# EAGLE design 517_lora_arduino_ES920 (EAGLE 9.6.2)
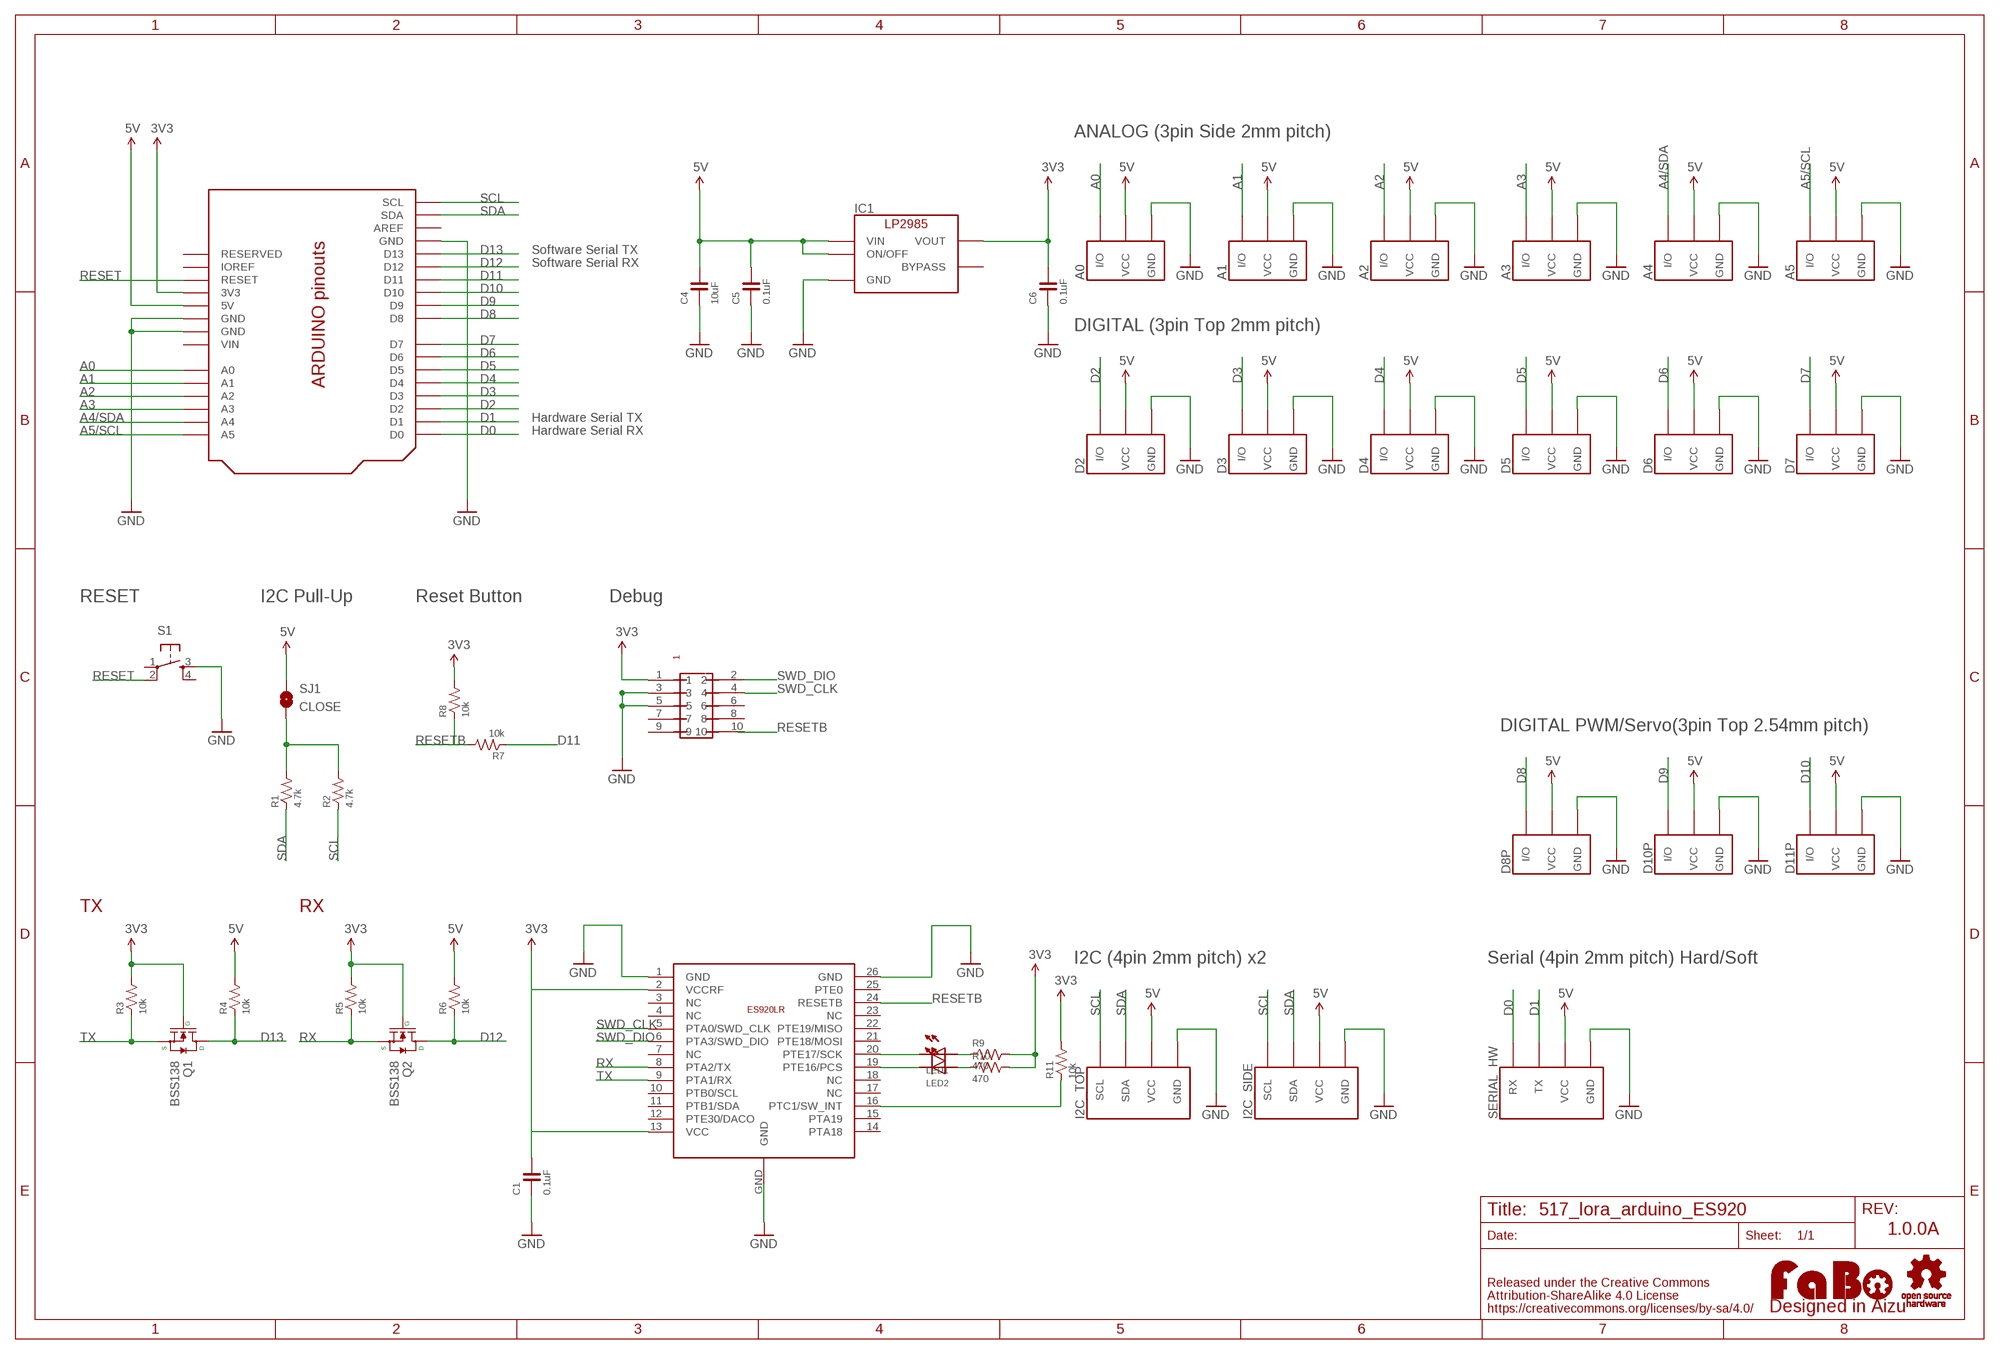
[diagram p0: schematic, sheet 1]

## Parts
A0  FABO_BRICK_3PIN-S03B-PASK-2_LONG  [FABO_BRICK_3PIN_S03B-PASK-2_LONG]
A1  FABO_BRICK_3PIN-S03B-PASK-2_LONG  [FABO_BRICK_3PIN_S03B-PASK-2_LONG]
A2  FABO_BRICK_3PIN-S03B-PASK-2_LONG  [FABO_BRICK_3PIN_S03B-PASK-2_LONG]
A3  FABO_BRICK_3PIN-S03B-PASK-2_LONG  [FABO_BRICK_3PIN_S03B-PASK-2_LONG]
A4  FABO_BRICK_3PIN-S03B-PASK-2_LONG  [FABO_BRICK_3PIN_S03B-PASK-2_LONG]
A5  FABO_BRICK_3PIN-S03B-PASK-2_LONG  [FABO_BRICK_3PIN_S03B-PASK-2_LONG]
C1  0.1uF  CAPACITOR-0603_NARROW  [0603-NARROW]
C4  10uF  CAPACITOR-0603_NARROW  [0603-NARROW]
C5  0.1uF  CAPACITOR-0603_NARROW  [0603-NARROW]
C6  0.1uF  CAPACITOR-0603_NARROW  [0603-NARROW]
D2  FABO_BRICK_3PIN-B03B-PASK-1  [FABO_BRICK_3PIN_B03B-PASK-1]
D3  FABO_BRICK_3PIN-B03B-PASK-1  [FABO_BRICK_3PIN_B03B-PASK-1]
D4  FABO_BRICK_3PIN-B03B-PASK-1  [FABO_BRICK_3PIN_B03B-PASK-1]
D5  FABO_BRICK_3PIN-B03B-PASK-1  [FABO_BRICK_3PIN_B03B-PASK-1]
D6  FABO_BRICK_3PIN-B03B-PASK-1  [FABO_BRICK_3PIN_B03B-PASK-1]
D7  FABO_BRICK_3PIN-B03B-PASK-1  [FABO_BRICK_3PIN_B03B-PASK-1]
D8P  FABO_BRICK_3PIN-HEADER  [FABO_BRICK_3PIN_HEADER]
D10P  FABO_BRICK_3PIN-HEADER  [FABO_BRICK_3PIN_HEADER]
D11P  FABO_BRICK_3PIN-HEADER  [FABO_BRICK_3PIN_HEADER]
I2C_SIDE  FABO_BRICK_I2C-S04B-PASK-2_LONG  [FABO_BRICK_I2C_S04B-PASK-2_LONG]
I2C_TOP  FABO_BRICK_I2C-B04B-PASK-1  [FABO_BRICK_I2C_B04B-PASK-1]
IC1  LP2985-33DBV  [SOT-23-5]
LED1  LED-0603  [0603]
LED2  LED-0603  [0603]
LOGO1  LOGO_FABO-M  [LOGO_FABO_M]
Q1  BSS138  MOSFET-N  [SOT23-3]
Q2  BSS138  MOSFET-N  [SOT23-3]
R1  4.7k  RESISTOR-0603  [0603]
R2  4.7k  RESISTOR-0603  [0603]
R3  10k  RESISTOR-0603-NARROW  [0603-NARROW]
R4  10k  RESISTOR-0603-NARROW  [0603-NARROW]
R5  10k  RESISTOR-0603-NARROW  [0603-NARROW]
R6  10k  RESISTOR-0603-NARROW  [0603-NARROW]
R7  10k  RESISTOR-0603-NARROW  [0603-NARROW]
R8  10k  RESISTOR-0603-NARROW  [0603-NARROW]
R9  470  RESISTOR-0603-NARROW  [0603-NARROW]
R10  470  RESISTOR-0603-NARROW  [0603-NARROW]
R11  10k  RESISTOR-0603-NARROW  [0603-NARROW]
S1  TACT-SWITCH-6MM  [DTS_6_V]
SERIAL_HW  FABO_BRICK_SERIAL-B04B-PASK-1  [FABO_BRICK_SERIAL_B04B-PASK-1]
SJ1  CLOSE  SMD-JUMPER-2-CLOSE  [SMD-JUMPER-2-CLOSE]
U1  ARDUINO_UNO_R3_SHIELD-OUTIN  [ARDUINO_SHIELD_OUTIN]
U$3  LOGO_OSHW-M_BOTTOM  [LOGO_OSHW_M_BOTTOM]
U$15  PIN-HEADER-SMT(1.27MM)2X5  [PIN-HEADER-SMT(1.27MM)2X5]
U$16  ES920LR  [ES920LR]

## Nets
3V3: C1.2 C6.2 IC1.5(VOUT) Q1.1(G) Q2.1(G) R3.2 R5.2 R8.2 R9.2 R10.2 R11.2 U1.3V3 U$15.1 U$16.2(VCCRF) U$16.13(VCC)
5V: A0.VCC A1.VCC A2.VCC A3.VCC A4.VCC A5.VCC C4.2 C5.2 D2.VCC D3.VCC D4.VCC D5.VCC D6.VCC D7.VCC D8P.VCC D10P.VCC D11P.VCC I2C_SIDE.VCC I2C_TOP.VCC IC1.1(VIN) IC1.3(ON/OFF) R4.2 R6.2 SERIAL_HW.VCC SJ1.1 U1.5V
A0: A0.I/O U1.A0
A1: A1.I/O U1.A1
A2: A2.I/O U1.A2
A3: A3.I/O U1.A3
A4/SDA: A4.I/O U1.A4
A5/SCL: A5.I/O U1.A5
D0: SERIAL_HW.RX U1.D0
D1: SERIAL_HW.TX U1.D1
D2: D2.I/O U1.D2
D3: D3.I/O U1.D3
D4: D4.I/O U1.D4
D5: D5.I/O U1.D5
D6: D6.I/O U1.D6
D7: D7.I/O U1.D7
D8: D8P.I/O U1.D8
D9: D10P.I/O U1.D9
D10: D11P.I/O U1.D10
D11: R7.1 U1.D11
D12: Q2.3(D) R6.1 U1.D12
D13: Q1.3(D) R4.1 U1.D13
GND: A0.GND A1.GND A2.GND A3.GND A4.GND A5.GND C1.1 C4.1 C5.1 C6.1 D2.GND D3.GND D4.GND D5.GND D6.GND D7.GND D8P.GND D10P.GND D11P.GND I2C_SIDE.GND I2C_TOP.GND IC1.2(GND) S1.3 SERIAL_HW.GND U1.GND1(GND) U1.GND2(GND) U1.GND3(GND) U$15.3 U$15.5 U$16.1(GND) U$16.26(GND) U$16.GND
N$1: R1.2 R2.2 SJ1.2
N$4: LED2.CATHODE U$16.19(PTE16/PCS)
N$5: LED1.CATHODE U$16.20(PTE17/SCK)
N$6: LED1.ANODE R9.1
N$7: LED2.ANODE R10.1
N$8: R11.1 U$16.16(PTC1/SW_INT)
RESET: S1.2 U1.RESET
RESETB: R7.2 R8.1 U$15.10 U$16.24(RESETB)
RX: Q2.2(S) R5.1 U$16.8(PTA2/TX)
SCL: I2C_SIDE.SCL I2C_TOP.SCL R2.1 U1.SCL
SDA: I2C_SIDE.SDA I2C_TOP.SDA R1.1 U1.SDA
SWD_CLK: U$15.4 U$16.5(PTA0/SWD_CLK)
SWD_DIO: U$15.2 U$16.6(PTA3/SWD_DIO)
TX: Q1.2(S) R3.1 U$16.9(PTA1/RX)
Unconnected: IC1.4(BYPASS) S1.1 S1.4 U1.AREF U1.IOREF U1.RESERVED U$15.6 U$15.7 U$15.8 U$15.9 U$16.3(NC) U$16.4(NC) U$16.7(NC) U$16.10(PTB0/SCL) U$16.11(PTB1/SDA) U$16.12(PTE30/DACO) U$16.14(PTA18) U$16.15(PTA19) U$16.17(NC) U$16.18(NC) U$16.21(PTE18/MOSI) U$16.22(PTE19/MISO) U$16.23(NC) U$16.25(PTE0)

## Notes on the sheet
- ANALOG (3pin Side 2mm pitch)
- Software Serial TX
- Software Serial RX
- DIGITAL (3pin Top 2mm pitch)
- Hardware Serial TX
- Hardware Serial RX
- RESET | I2C Pull-Up | Reset Button | Debug
- DIGITAL PWM/Servo(3pin Top 2.54mm pitch)
- TX | RX
- I2C (4pin 2mm pitch) x2 | Serial (4pin 2mm pitch) Hard/Soft
- 1.0.0A

## Power pins joined to a net without a drawn wire
VIN: U1.VIN

## Library data of the parts
A0 A1-A5 D2-D7 D8P D10P D11P = FaBo-Template:FABO_BRICK_3PIN: FaBo Brick 3pin
C1 C4-C6 = FaBo-Capacitor:CAPACITOR: CAPACITOR
I2C_SIDE I2C_TOP = FaBo-Template:FABO_BRICK_I2C: FaBo Brick I2C
IC1 = FaBo-Supply:LP2985: LP2985
LED1 LED2 = FaBo-LED:LED
LOGO1 = component:LOGO_FABO
Q1 Q2 = FaBo-etc:MOSFET-N
R1-R11 = FaBo-Resistors:RESISTOR: RESISTOR
S1 = FaBo-Switch:TACT-SWITCH
SERIAL_HW = FaBo-Template:FABO_BRICK_SERIAL: FaBo Brick Serial
SJ1 = FaBo-Supply:SMD-JUMPER-2
U1 = FaBo-Boards:ARDUINO_UNO_R3_SHIELD
U$3 = component:LOGO_OSHW
U$15 = GClue:PIN-HEADER-SMT(1.27MM)2X5: PIN-HEADER-SMT (1.27MM) 2x5
U$16 = FaBo-LoRa:ES920LR

## Board
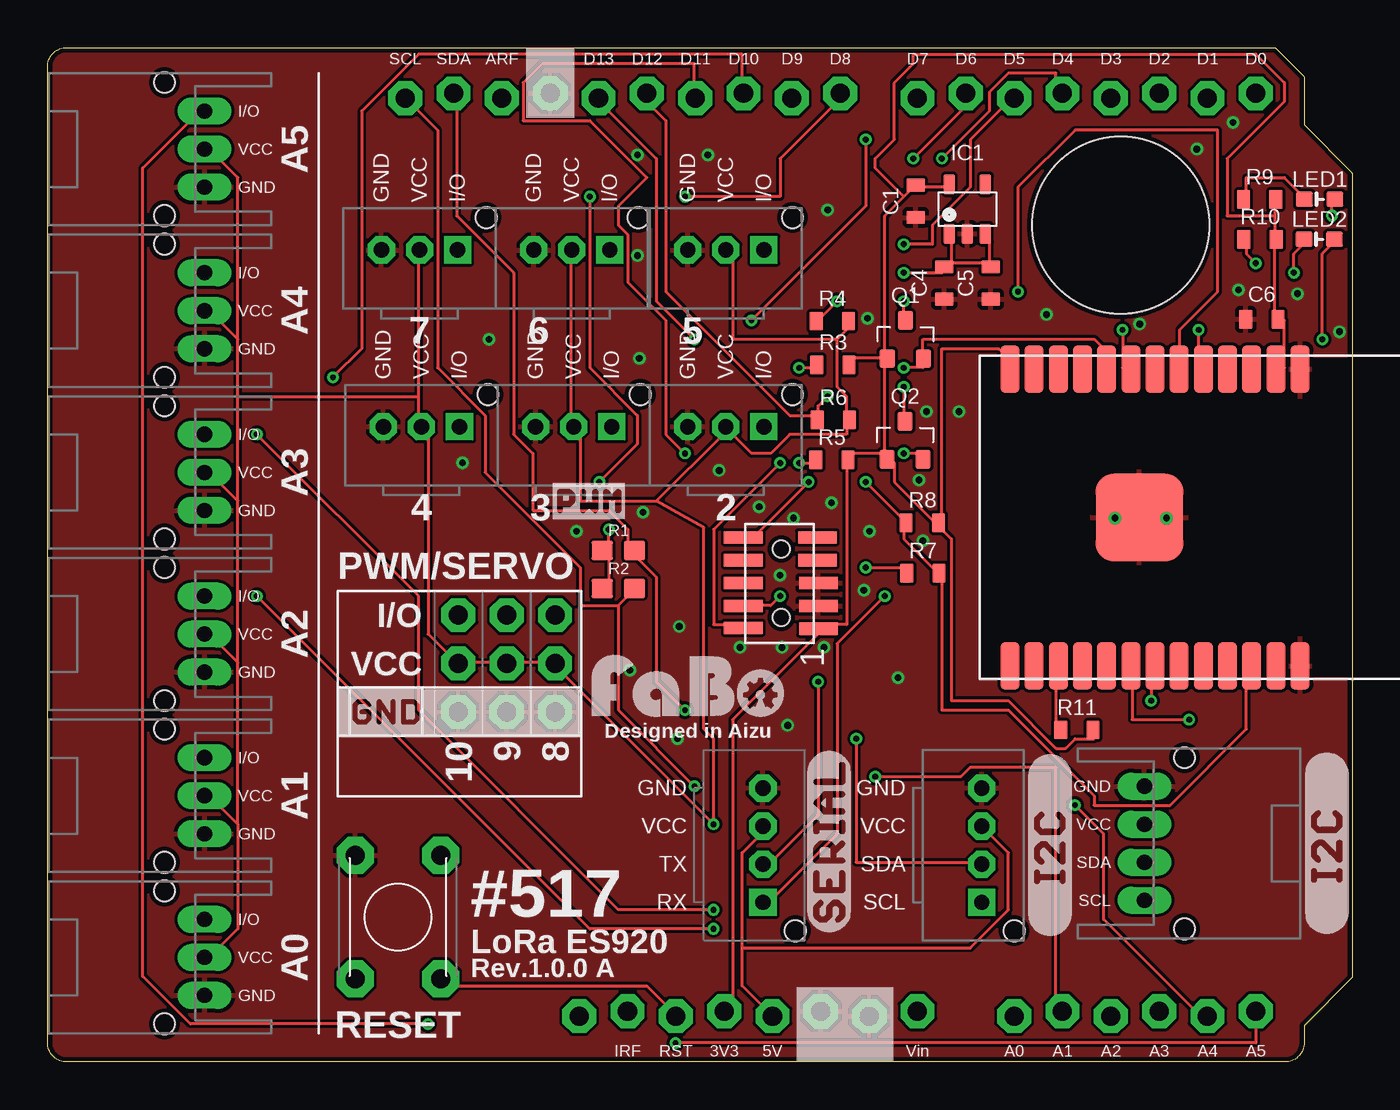
[diagram p1: board, top side]
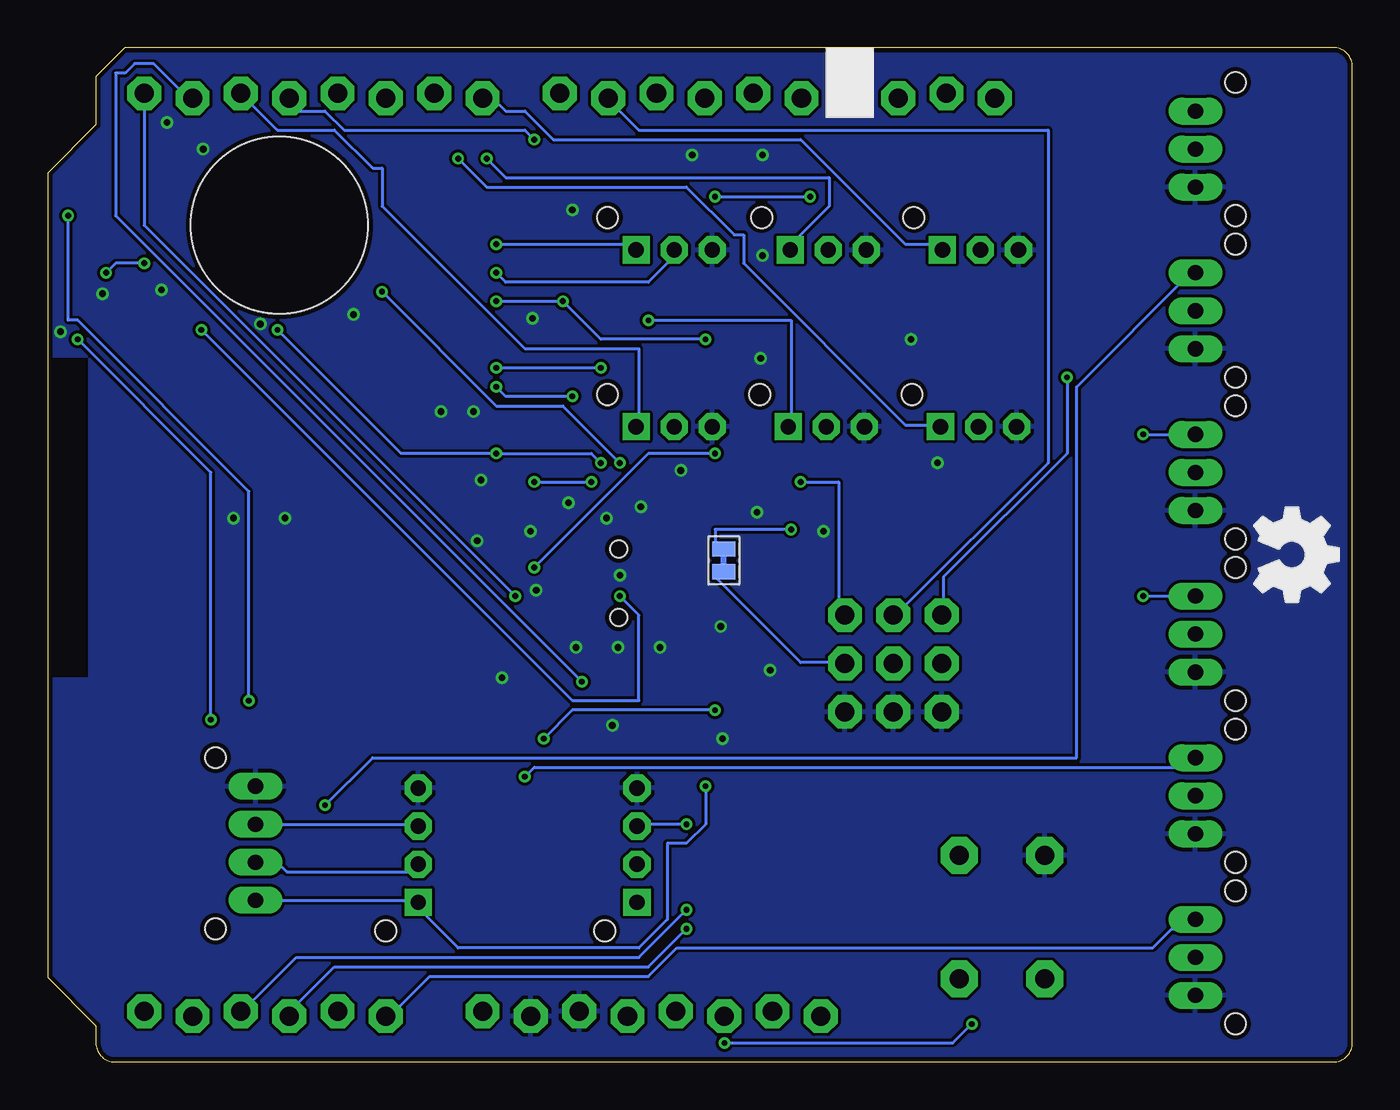
[diagram p2: board, bottom side, seen from below]

Size 68.58 x 53.34 mm. Coordinates in mm from the lower left corner, seen from the top.
Copper layers (1*16): Top 0.035mm / dielectric 1.6mm / Bottom 0.035mm
Design rules "PCBway": minimum track width 6mil, minimum drill 12mil, track to track 6mil, track to pad 6mil, pad to pad 6mil, via to via 6mil, smd to smd 6mil, copper to edge 10mil, drill to drill 10mil, minimum pad ring 10mil, minimum via ring 6mil, stop-mask expansion 2mil, vias tented up to drill 100mil, thermal gap 8mil
Holes 9.3 mm at 56.4,44

### Footprints (pad centres in the part's own frame; a part is rotated, then mirrored left to right if it is on the bottom)
FABO_BRICK_3PIN_S03B-PASK-2_LONG = drill 0.8 pad 1.422 long: GND -2,0; I/O 2,0; VCC 0,0 | hole 1.1: 3.5,2.1; -3.5,2.1
0603-NARROW = smd 0.71 x 1: 1 -0.85,0; 2 0.85,0
FABO_BRICK_3PIN_B03B-PASK-1 = drill 0.8 pad 1.422 octagon: GND -2,0; VCC 0,0 | drill 0.8 pad 1.422 square: I/O 2,0 | hole 1.1: 3.5,1.7
FABO_BRICK_3PIN_HEADER = drill 1 pad 1.778 octagon: GND -2.54,0; I/O 2.54,0; VCC 0,0
FABO_BRICK_I2C_S04B-PASK-2_LONG = drill 0.8 pad 1.422 long: GND -3,0; SCL 3,0; SDA 1,0; VCC -1,0 | hole 1.1: 4.5,2.1; -4.5,2.1
FABO_BRICK_I2C_B04B-PASK-1 = drill 0.8 pad 1.422 octagon: GND -3,0; SDA 1,0; VCC -1,0 | drill 0.8 pad 1.422 square: SCL 3,0 | hole 1.1: 4.5,1.7
SOT-23-5 = smd 0.6 x 1.05: 1 -0.95,-1.3; 2 0,-1.3; 3 0.95,-1.3; 4 0.95,1.3; 5 -0.95,1.3
0603 = smd 0.9 x 0.8: ANODE -0.8,0; CATHODE 0.8,0
SOT23-3 = smd 0.8 x 1: 1 -0.95,-1; 2 0.95,-1; 3 0,1
0603' = smd 1.1 x 1: 1 -0.85,0; 2 0.85,0
DTS_6_V = drill 1 pad 1.93 octagon: 1 -3.25,2.25; 2 3.25,2.25; 3 -3.25,-2.25; 4 3.25,-2.25
FABO_BRICK_SERIAL_B04B-PASK-1 = drill 0.8 pad 1.422 octagon: GND -3,0; TX 1,0; VCC -1,0 | drill 0.8 pad 1.422 square: RX 3,0 | hole 1.1: 4.5,1.7
SMD-JUMPER-2-CLOSE = smd 0.8 x 1.2: 1 -0.6,0; 2 0.6,0
ARDUINO_SHIELD_OUTIN = drill 1 pad 1.778 octagon: 3V3 35.56,2.667; 5V 38.1,2.413; A0 50.8,2.413; A1 53.34,2.667; A2 55.88,2.413; A3 58.42,2.667; A4 60.96,2.413; A5 63.5,2.667; AREF 23.876,50.673; D0 63.5,50.927; D1 60.96,50.673; D2 58.42,50.927; D3 55.88,50.673; D4 53.34,50.927; D5 50.8,50.673; D6 48.26,50.927; D7 45.72,50.673; D8 41.656,50.927; D9 39.116,50.673; D10 36.576,50.927; D11 34.036,50.673; D12 31.496,50.927; D13 28.956,50.673; GND1 43.18,2.413; GND2 40.64,2.667; GND3 26.416,50.927; IOREF 30.48,2.667; RESERVED 27.94,2.413; RESET 33.02,2.413; SCL 18.796,50.673; SDA 21.336,50.927; VIN 45.72,2.667
PIN-HEADER-SMT(1.27MM)2X5 = smd 0.635 x 2.032: 1 -2.4,-1.95; 2 -2.35,2; 3 -1.2,-1.95; 4 -1.2,2; 5 0,-1.95; 6 0,2; 7 1.2,-1.9; 8 1.2,2; 9 2.4,-1.9; 10 2.4,2 | hole 0.9: 1.8,0; -1.8,0
ES920LR = smd 2.5 x 1: 1 -7.8,5.84; 2 -7.8,4.57; 3 -7.8,3.3; 4 -7.8,2.03; 5 -7.8,0.76; 6 -7.8,-0.51; 7 -7.8,-1.78; 8 -7.8,-3.05; 9 -7.8,-4.32; 10 -7.8,-5.59; 11 -7.8,-6.86; 12 -7.8,-8.13; 13 -7.8,-9.4; 14 7.8,-9.4; 15 7.8,-8.13; 16 7.8,-6.86; 17 7.8,-5.59; 18 7.8,-4.32; 19 7.8,-3.05; 20 7.8,-1.78; 21 7.8,-0.51; 22 7.8,0.76; 23 7.8,2.03; 24 7.8,3.3; 25 7.8,4.57; 26 7.8,5.84 | smd 4.6 x 4.6: GND 0,-2.6

### Placement (x,y rotation side)
A0  8.25,5.5 90 top
A1  8.25,14 90 top
A2  8.25,22.5 90 top
A3  8.25,31 90 top
A4  8.25,39.5 90 top
A5  8.25,48 90 top
C1  45.62,45.26 90 top
C4  47.12,40.95 90 top
C5  49.57,40.95 90 top
C6  63.81,39.05 0 top
D2  35.65,33.4 0 top
D3  27.65,33.4 0 top
D4  19.65,33.4 0 top
D5  35.65,42.7 0 top
D6  27.55,42.7 0 top
D7  19.55,42.7 0 top
D8P  26.67,20.95 90 top
D10P  24.13,20.95 90 top
D11P  21.59,20.95 90 top
I2C_SIDE  57.65,11.5 270 top
I2C_TOP  49.1,11.4 270 top
IC1  48.34,44.85 0 top
LED1  66.86,45.36 0 top
LED2  66.83,43.26 0 top
LOGO1  33.66,17.78 0 top
Q1  45.09,37.98 0 top
Q2  45.06,32.69 0 top
R1  4.7k  [0603']  30,26.9 180 top
R2  4.7k  [0603']  30,24.9 180 top
R3  41.27,36.66 0 top
R4  41.24,38.96 0 top
R5  41.22,31.66 0 top
R6  41.3,33.76 0 top
R7  46,25.7 0 top
R8  45.97,28.36 0 top
R9  63.7,45.35 0 top
R10  63.72,43.26 0 top
R11  54.09,17.46 0 top
S1  18.41,7.62 270 top
SERIAL_HW  37.6,11.4 270 top
SJ1  33.03,26.37 90 bottom
U1  0,0 0 top
U$2  [LOGO_SILK_SERIAL2]  42.25,11.6 90 top
U$3  3.17,26.67 90 top
U$5  [LOGO_SILK_PWM]  26.55,28.55 0 top
U$11  [LOGO_SILK_I2C]  68.4,11.5 90 top
U$12  [LOGO_SILK_I2C]  53.85,11.4 90 top
U$15  38.56,25.18 90 top
U$16  59.98,28.64 270 top
U$19  [LOGO_SILK_GND]  15.88,17.14 0 top

### Tracks (layer width: path | path; a pad name or v marks a point on that pad's centre or on a via)
3V3
  Top 0.152: 64.5,44.5 64.5,45 R9.2 | 64.5,44.5 64.5,43.5 R10.2 64.5,43 64.5,39.5 C6.2 65,39 65,36.5 U$16.2 | IC1.5 47.5,46 46,46 C1.2 45.5,46 45,45.5 | 44,37 42,37 R3.2 | 45,45.5 44,44.5 44,37 | 44,37 Q1.1 44,36.5 44,32 | 64.5,44.5 62,44.5 62,47.5 65,50.5 65,51.5 63.5,53 45.5,53 45.5,52.5 44.5,51.5 44.5,48.5 43.5,47.5 43.5,47 45,45.5 | 44,32 42,32 R5.2 42,31.5 42,23 41,23 U$15.1 40.5,22.5 36,18 36,3 U1.3V3 | R8.2 46.5,28.5 44.5,30.5 44.5,31.5 Q2.1 44,32 | R11.2 55,17 54,17 53.5,16.5 53,16.5 50.5,19 47.5,19 47.5,27.5 47,28 R8.2 | U$16.13 50.5,36.5 50.5,37 50,37.5 47,37.5 47,28.5 R8.2
5V  (via drill 0.3)
  Top 0.152: D6.VCC 27.5,42.5 27.5,33.5 D3.VCC 28,33 28,29.5 32,29.5 | 32,29.5 35.5,33 D2.VCC 36,33 37,32 38,32 39,33 42,33 42,33.5 R6.2 42,34 42,35 41.5,35.5 41.5,38 | 41.5,38 42,38.5 R4.2 | 47.5,42 47.5,43.5 IC1.1 | 49.5,42 49.5,43.5 IC1.3 | 49.5,42 47.5,42 | 47.5,42 C4.2 47,41.5 v45,41.5 | 49.5,42 C5.2 | 41.5,38 36,38 36,42.5 D5.VCC | 36.5,6 36.5,4 38,2.5 U1.5V | 36.5,6 36.5,11 37.5,12 SERIAL_HW.VCC | I2C_TOP.VCC 50.5,11 50.5,8 48.5,6 36.5,6 | 19.5,35 19.5,33.5 D4.VCC 20,33 20,22.5 21.5,21 D11P.VCC 22,21 24,21 D10P.VCC 24.5,21 26.5,21 D8P.VCC 27,20.5 v35,12.5 35,17 34.5,17.5 34.5,28.1 32,29.5 | 19.5,35 19.5,42.5 D7.VCC | 10,12.5 10,7 8.5,5.5 A0.VCC | 10,12.5 8.5,14 A1.VCC | 10,21 8.5,22.5 A2.VCC | 10,12.5 10,21 | 10,29.5 8.5,31 A3.VCC | 10,21 10,29.5 | 10,38 8.5,39.5 A4.VCC | 10,29.5 10,35 | 10,35 10,38 | 10,38 10,46.5 8.5,48 A5.VCC | 10,35 19.5,35
  Bottom 0.152: v45,41.5 44.5,41 37,41 35.5,42.5 D5.VCC | I2C_SIDE.VCC 49.5,12.5 I2C_TOP.VCC | SJ1.1 33.5,25.5 29,21 27,21 D8P.VCC | v35,12.5 37.5,12.5 SERIAL_HW.VCC
A0
  Bottom 0.152: A0.I/O 8.5,7.5 9,7 9.5,7 10.5,6 35.5,6 37,4.5 48.5,4.5 50.5,2.5 U1.A0
A1  (via drill 0.3)
  Top 0.152: v43.5,15 48,15 48.5,15.5 53,15.5 53,3 U1.A1
  Bottom 0.152: v43.5,15 43,15.5 9,15.5 8.5,16 A1.I/O
A2  (via drill 0.3)
  Top 0.152: v11,24.5 28.5,7 v35,7
  Bottom 0.152: v11,24.5 A2.I/O | v35,7 37,5 53.5,5 56,2.5 U1.A2
A3  (via drill 0.3)
  Top 0.152: v11,33 19.5,24.5 19.5,18.5 30,8 v35,8
  Bottom 0.152: v11,33 A3.I/O | v35,8 37.5,5.5 55.5,5.5 58,3 U1.A3
A4/SDA  (via drill 0.3)
  Top 0.152: v54,13.5 55.5,12 55.5,7.5 60.5,2.5 U1.A4
  Bottom 0.152: v54,13.5 51.5,16 14.5,16 14.5,35.5 8.5,41.5 A4.I/O
A5/SCL  (via drill 0.3)
  Top 0.152: v20,2 7.5,2 5,4.5 5,47 8,50 A5.I/O | v33,1 63.5,1 U1.A5
  Bottom 0.152: v20,2 21,1 v33,1
D0  (via drill 0.3)
  Top 0.152: v44,24.5 41.5,22 41.5,12 38,8.5 SERIAL_HW.RX
  Bottom 0.152: v44,24.5 63.5,44 U1.D0
D1  (via drill 0.3)
  Top 0.152: v40.5,20 40.5,13 38,10.5 SERIAL_HW.TX
  Bottom 0.152: v40.5,20 65,44.5 65,52 64.5,52 64,52.5 63,52.5 61.5,51 61,51 U1.D1
D2
  Bottom 0.152: D2.I/O 37.5,33.5 37.5,37.5 43.5,37.5 51,45 51,47 51.5,47 53.5,49 56.5,49 58,50.5 U1.D2
D3  (via drill 0.3)
  Top 0.152: v37,39 43,45 v43,48.5
  Bottom 0.152: v37,39 29.5,39 29.5,33.5 D3.I/O | v43,48.5 43.5,49 53,49 54,50 55.5,50 56,50.5 U1.D3
D4  (via drill 0.3)
  Top 0.152: v47,47.5 49.5,50 49.5,51 50.5,52 53,52 53,51 U1.D4
  Bottom 0.152: v47,47.5 45.5,46 35,46 32.5,43.5 32,43.5 32,42 23.5,33.5 22,33.5 D4.I/O
D5  (via drill 0.3)
  Top 0.152: v45,43 46.5,43 46.5,44 48.5,46 48.5,48.5 50.5,50.5 U1.D5
  Bottom 0.152: v45,43 38,43 D5.I/O
D6  (via drill 0.3)
  Top 0.152: v45.5,47.5 48,50 48,50.5 U1.D6
  Bottom 0.152: v45.5,47.5 44.5,46.5 27.5,46.5 27.5,45 29.5,43 D6.I/O
D7
  Bottom 0.152: D7.I/O 22,43 23.5,43 29,48.5 42,48.5 43.5,50 44.5,50 45,50.5 45.5,50.5 U1.D7
D8  (via drill 0.3)
  Top 0.152: v29,30.5 31,32.5 31,34 28.5,36.5 v28.5,45.5 | v33.5,45.5 38.5,45.5 38.5,47.5 41.5,50.5 U1.D8
  Bottom 0.152: v29,30.5 27,30.5 27,23.5 D8P.I/O | v33.5,45.5 v28.5,45.5
D9
  Bottom 0.152: D10P.I/O 24,23.5 16,31.5 16,49 37.5,49 39,50.5 U1.D9
D10  (via drill 0.3)
  Top 0.152: v15,36 16.5,37.5 16.5,50 19.5,53 36.5,53 36.5,51 U1.D10
  Bottom 0.152: v15,36 15,32 21.5,25.5 21.5,23.5 D11P.I/O
D11  (via drill 0.3)
  Top 0.152: v43,26 45,26 R7.1 | v33.5,32 32.5,33 32.5,39 30.5,41 30.5,43.5 30,44 30,45 31.5,46.5 28.5,49.5 25,49.5 25,51.5 26,52.5 34,52.5 34,51 U1.D11
  Bottom 0.152: v43,26 37,32 v33.5,32
D12  (via drill 0.3)
  Top 0.152: 40.5,34 39,34 32.5,40.5 32.5,49.5 31.5,50.5 U1.D12 | v45,35.5 45,34 Q2.3 | v41,35 40.5,34.5 40.5,34 | 40.5,34 R6.1
  Bottom 0.152: v45,35.5 44.5,35 v41,35
D13  (via drill 0.3)
  Top 0.152: v41.5,40 40.5,39 R4.1 | v45,40 45,39 Q1.3 | v34,38 32,40 32,47.5 29,50.5 U1.D13
  Bottom 0.152: v45,40 v41.5,40 39.5,38 v34,38
GND  (via drill 0.35)
  other vias: 41,44.8 60.4,48 52.5,39.3 47.9,34.2 31.1,37 23.2,38 62.3,49.4 67.9,38.4 56.1,28.6 58.8,28.6 41.2,29.4 35.3,31.1 21.8,31.5 62.6,40.6 65.7,40.4 42.9,24.8 43.2,27.9 37.4,29.2 33.2,22.9 27.8,27.9 33.1,17 31,47.7 31,42.4 31.3,28.9 30.6,20.6 46.2,34.2 45.8,30.6 34.7,47.7 44.7,20.2 40.8,21.8 38.6,21.8 36.4,21.8 39.2,28.6 38.9,17.7 38.5,25.6 43.1,39.1 57.4,38.8 46,27.4
  pour Bottom: 0,0 0,53.34 68.58,53.34 68.58,1.27 68.58,0
  pour Top: 0,0 0,53.34 68.58,53.34 68.58,0
N$1  (via drill 0.3)
  Top 0.152: R2.2 29.5,25 29.5,26.5 R1.2 29.5,27 v29.5,28
  Bottom 0.152: v29.5,28 33.5,28 33.5,27 SJ1.2
N$4  (via drill 0.3)
  Top 0.152: v67,38 67,42.5 67.5,43 LED2.CATHODE | v60,18 57,18 57,20.5 U$16.19
  Bottom 0.152: v67,38 60,31 v60,18
N$5  (via drill 0.3)
  Top 0.152: v67.5,44.5 67.5,45 LED1.CATHODE | v58,19 58,20.5 U$16.20
  Bottom 0.152: v67.5,44.5 67.5,39 67,39 58,30 v58,19
N$6
  Top 0.152: LED1.ANODE 66,45.5 65,46.5 63,46.5 63,45.5 R9.1
N$7  (via drill 0.3)
  Top 0.152: v65.5,41.5 65.5,42.5 66,43 LED2.ANODE | v63.5,42 63,42.5 63,43 R10.1
  Bottom 0.152: v65.5,41.5 65,42 v63.5,42
N$8
  Top 0.152: R11.1 53,17.5 53,20.5 U$16.16
RESET
  Top 0.152: U1.RESET 33,2.5 31.5,4 21,4 S1.2
RESETB  (via drill 0.3)
  Top 0.152: v40,30.5 37,27.5 U$15.10 | v43,30.5 45,28.5 R8.1 45,28 45,27.5 46.5,26 R7.2 47,25.5 47,18.5 50.5,18.5 55,14 55,13.5 59,13.5 63,17.5 63,20.5 U$16.24
  Bottom 0.152: v43,30.5 v40,30.5
RX  (via drill 0.3)
  Top 0.152: v39.5,31.5 40.5,31.5 R5.1 | v45,32 46,32 Q2.2 | v56.5,38.5 56.5,36.5 U$16.8
  Bottom 0.152: v39.5,31.5 40,32 v45,32 50,32 v56.5,38.5
SCL  (via drill 0.3)
  Top 0.152: 30,24 30.5,24.5 R2.1 | 30,24 28,24 28,26 23,31 23,34 20.5,36.5 20.5,49 19,50.5 U1.SCL | v34,14.5 30,18.5 30,24
  Bottom 0.152: I2C_SIDE.SCL 49.5,8.5 I2C_TOP.SCL 49,8 47,6 37.5,6 36,7.5 36,11.5 35,11.5 34,12.5 v34,14.5
SDA  (via drill 0.3)
  Top 0.152: U1.SDA 21.5,50.5 21.5,44.5 24.5,41.5 24.5,33 25.5,32 25.5,29 29.5,29 30.5,28 30.5,27 R1.1 31,26.5 32,25.5 32,20 v33.5,18.5 | v42.5,17 42.5,10.5 49,10.5 I2C_TOP.SDA
  Bottom 0.152: I2C_SIDE.SDA 56.5,10.5 56,10 49.5,10 I2C_TOP.SDA | v42.5,17 41,18.5 v33.5,18.5
SWD_CLK  (via drill 0.3)
  Top 0.152: v38.5,24.5 38,24 37,24 U$15.4 | v60.5,38.5 60.5,36.5 U$16.5
  Bottom 0.152: v38.5,24.5 37.5,23.5 37.5,19 41,19 v60.5,38.5
SWD_DIO  (via drill 0.3)
  Top 0.152: v38.5,31.5 35,28 35,23 36.5,23 U$15.2 | v51,40.5 51,46 54,49 61.5,49 61.5,40.5 59.5,38.5 59.5,36.5 U$16.6
  Bottom 0.152: v38.5,31.5 41.5,34.5 45,34.5 v51,40.5
TX  (via drill 0.3)
  Top 0.152: v39.5,36.5 40.5,36.5 R3.1 | v45,36.5 46,36.5 Q1.2 46,37 46,38 55,38 55.5,37.5 55.5,36.5 U$16.9
  Bottom 0.152: v45,36.5 v39.5,36.5

### Text on the board
tPlace: SCL | SDA | ARF | D13 | D12 | D11 | D10 | D9 | D8 | D7 | D6 | D5 | D4 | D3 | D2 | D1 | D0 | I/O | VCC | GND | GND | VCC | I/O | GND | VCC | I/O | GND | VCC | I/O | I/O | VCC | 7 | 6 | 5 | GND | GND | VCC | I/O | GND | VCC | I/O | GND | VCC | I/O | I/O | VCC | 4 | 3 | 2 | GND | PWM/SERVO | I/O | I/O | VCC | VCC | GND | Designed in Aizu | 10 | 9 | 8 | I/O | VCC | GND | GND | GND | GND | VCC | VCC | VCC | TX | SDA | SDA | I/O | #517 | RX | SCL | SCL | VCC | LoRa ES920 | GND | Rev.1.0.0 A | RESET | IRF | RST | 3V3 | 5V | Vin | A0 | A1 | A2 | A3 | A4 | A5